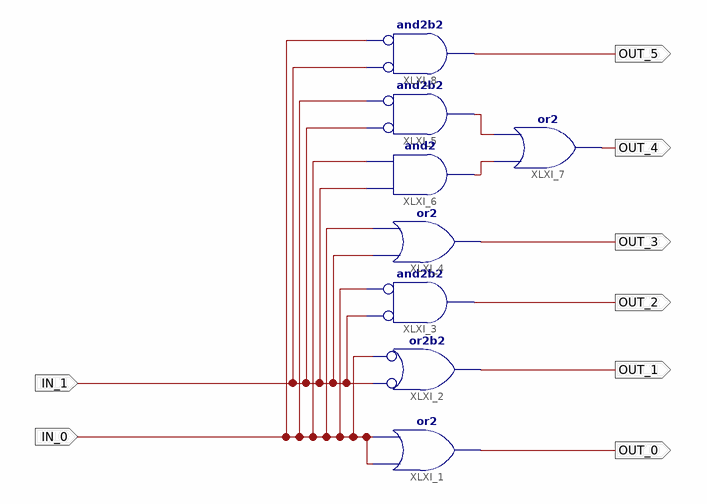
[diagram p0: schematic sheet 1]
// Xilinx ISE schematic My2To6Decoder.sch (spartan3a) as structural Verilog: 8 symbols, 8 ports
module My2To6Decoder (
  input  IN_0,
  input  IN_1,
  output OUT_0,
  output OUT_1,
  output OUT_2,
  output OUT_3,
  output OUT_4,
  output OUT_5
);

  wire XLXN_13, XLXN_14;

  or XLXI_1 (OUT_0, IN_0, IN_0);
  or XLXI_2 (OUT_1, ~IN_1, ~IN_0);  // or2b2
  and XLXI_3 (OUT_2, ~IN_1, ~IN_0);  // and2b2
  or XLXI_4 (OUT_3, IN_1, IN_0);
  and XLXI_5 (XLXN_13, ~IN_1, ~IN_0);  // and2b2
  and XLXI_6 (XLXN_14, IN_1, IN_0);
  or XLXI_7 (OUT_4, XLXN_14, XLXN_13);
  and XLXI_8 (OUT_5, ~IN_1, ~IN_0);  // and2b2
endmodule
